# Altium schematic sheet Buck_Converter.SchDoc
size A4; SheetNumber: 1; SheetTotal: 1
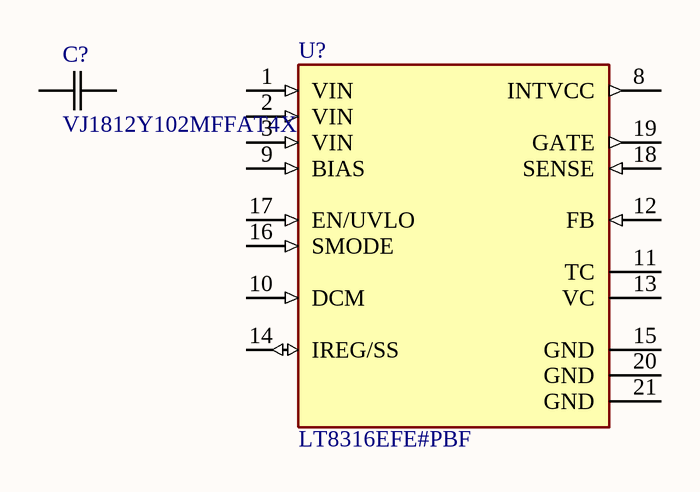
[diagram p0: Buck_Converter.SchDoc]

## Parts
C?  VJ1812Y102MFFAT4X  [CAP_2MFFAT4X_VIS-M]
U?  LT8316EFE#PBF  [IC_LT8316EFE#PBF]

## Nets

Not connected (* = marked no-connect by the designer): C? 1 2; U? 1(VIN) 2(VIN) 3(VIN) 8(INTVCC) 9(BIAS) 10(DCM) 11(TC) 12(FB) 13(VC) 14(IREG/SS) 15(GND) 16(SMODE) 17(EN/UVLO) 18(SENSE) 19(GATE) 20(GND) 21(GND)

## Library data of the parts
C? = VJ1812Y102MFFAT4X: No Description Available; Mfr_Name: Vishay; Type: DEV; Copyright: Copyright (C) 2024 Ultra Librarian. All rights reserved.; Manufacturer_Part_Number: VJ1812Y102MFFAT4X; RefDes: RefDes
U? = LT8316EFE#PBF: 560VIN Micropower No-Opto Isolated Flyback Controller; MF: Analog Devices; Value: *; SnapEDA_Link: https://www.snapeda.com/parts/LT8316EFE%23PBF/Analog+Devices/view-part/?ref=snap; Purchase-URL: https://pricing.snapeda.com/search/part/LT8316EFE#PBF/?ref=eda; Availability: In Stock; Price: None; Package: TSSOP -20 Analog Devices; Check_prices: https://www.snapeda.com/parts/LT8316EFE%23PBF/Analog+Devices/view-part/?ref=eda; MP: LT8316EFE#PBF